# Altium project ContollerRMC.PrjPcb
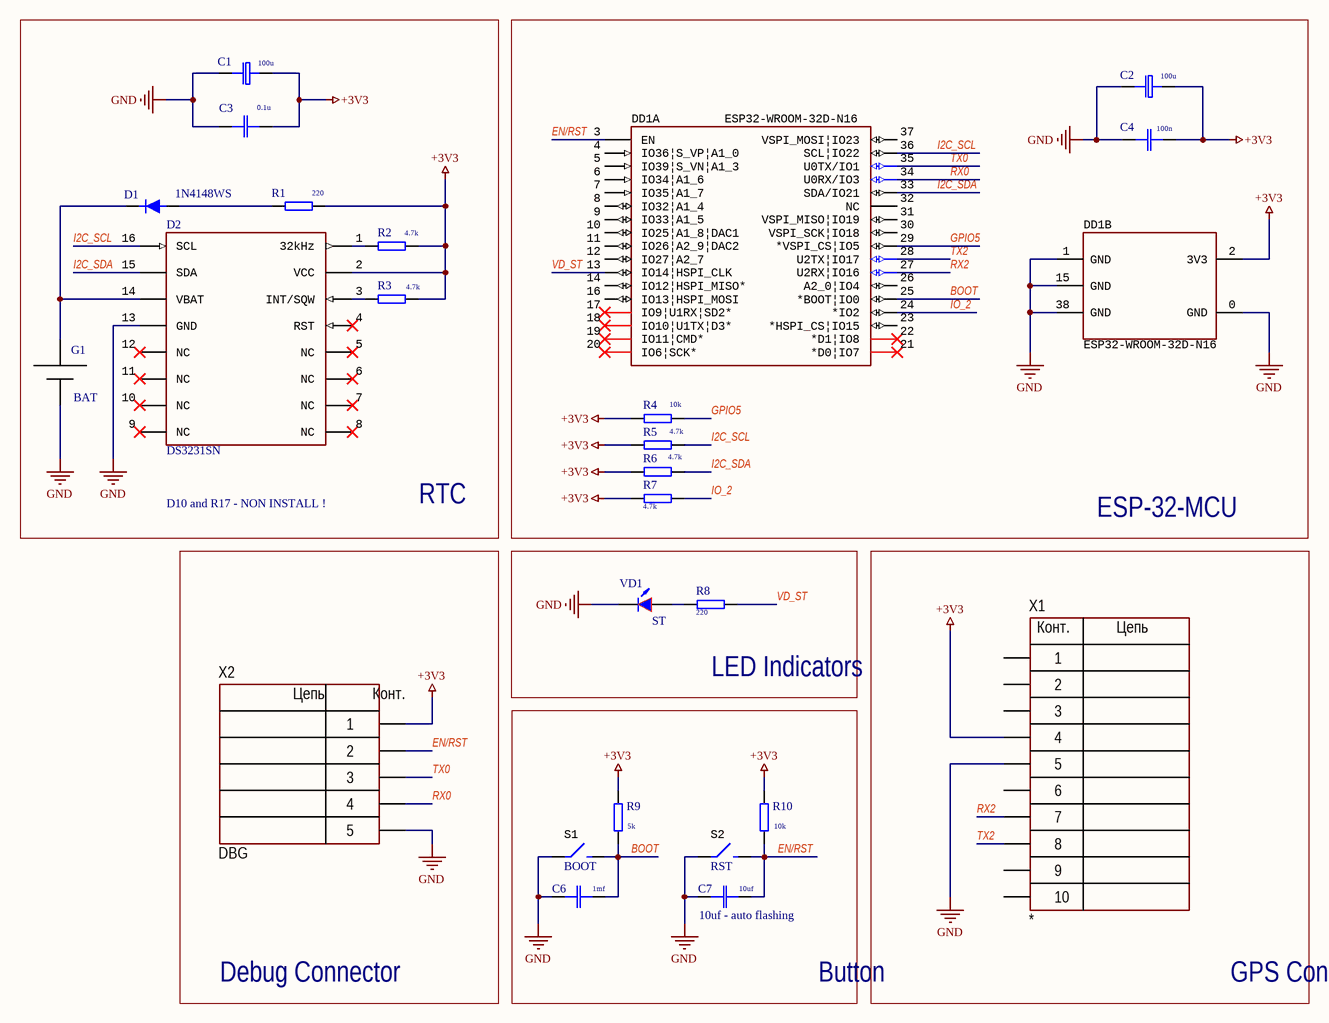
[diagram p0: ContollerRMC.SchDoc]
1 sheet, 25 parts. Net scope: global (net labels, ports and power ports of the same name join across sheets).
Board file: ContollerRMC.PcbDoc

## Sheet ContollerRMC.SchDoc: 0846 ControllerBoard
size A3; Revision: rev.0

### Parts
C1  100u  [EL Case C (6032-28)]
C2  100u  [EL Case C (6032-28)]
C3  0.1u  [C0805(2013)]
C4  100n  [C1206(3216)]
C6  1mf  [C0805(2013)]
C7  10uf  [C0805(2013)]
D1  1N4148WS  [SOD323]
D2  DS3231SN  [SO16-300]
DD1  PartNumber: ESP32-WROOM-32D-N16  [ESP32-WROOM-32D]  (parts A,B of 2)
G1  BAT  [BAT: BTH-R36-20]
R1  220  [R0805]
R2  4.7k  [R0805]
R3  4.7k  [R0805]
R4  10k  [R0805]
R5  4.7k  [R0805]
R6  4.7k  [R0805]
R7  4.7k  [R0805]
R8  220  [R0805]
R9  5k  [R0805]
R10  10k  [R0805]
S1  BOOT  [BUT_SKRPACE010]
S2  RST  [BUT_SKRPACE010]
VD1  ST  [Led 0805-Blue]
X1  *  [CON: PLS-10 - 2.0mm]
X2  DBG  [CON: PLS-5]

### Blocks framed on the sheet
RTC: C1 C3 D1 D2 G1 R1-R3
ESP-32-MCU: C2 C4 DD1 R4-R7
Debug Connector: X2
LED Indicators: R8 VD1
GPS Connector: X1
Button: C6 C7 R9 R10 S1 S2

### Nets
+3V3: C1.1 C2.1 C3.2 C4.1 D2.2(VCC) DD1.2(3V3) R1.1 R2.2 R3.2 R4.1 R5.1 R6.1 R7.2 R9.1 R10.1 X1.4 X2.1
GND: C1.2 C2.2 C3.1 C4.2 C6.2 C7.2 D2.13(GND) DD1.0(GND) DD1.1(GND) DD1.15(GND) DD1.38(GND) G1.2(-) S1.1 S2.1 VD1.2(K) X1.5 X2.5
BOOT: C6.1 DD1.25(*BOOT|IO0) R9.2 S1.2
EN/RST: C7.1 DD1.3(EN) R10.2 S2.2 X2.2
GPIO5: DD1.29(*VSPI_CS|IO5) R4.2
I2C_SCL: D2.16(SCL) DD1.36(SCL|IO22) R5.2
I2C_SDA: D2.15(SDA) DD1.33(SDA/IO21) R6.2
IO_2: DD1.24(*IO2) R7.1
RX0: DD1.34(U0RX/IO3) X2.4
RX2: DD1.27(U2RX|IO16) X1.7
TX0: DD1.35(U0TX/IO1) X2.3
TX2: DD1.28(U2TX|IO17) X1.8
VD_ST: DD1.13(IO14|HSPI_CLK) R8.2
NetD1_1: D1.1(A) R1.2
NetD1_2: D1.2(C) D2.14(VBAT) G1.1(+)
NetD2_1: D2.1(32kHz) R2.1
NetD2_3: D2.3(INT/SQW) R3.1
NetR8_1: R8.1 VD1.1(A)

Not connected (* = marked no-connect by the designer): D2 4(RST)* 5(NC)* 6(NC)* 7(NC)* 8(NC)* 9(NC)* 10(NC)* 11(NC)* 12(NC)*; DD1 4(IO36|S_VP|A1_0) 5(IO39|S_VN|A1_3) 6(IO34|A1_6) 7(IO35|A1_7) 8(IO32|A1_4) 9(IO33|A1_5) 10(IO25|A1_8|DAC1) 11(IO26|A2_9|DAC2) 12(IO27|A2_7) 14(IO12|HSPI_MISO*) 16(IO13|HSPI_MOSI) 17(IO9|U1RX|SD2*)* 18(IO10|U1TX|D3*)* 19(IO11|CMD*)* 20(IO6|SCK*)* 21(*D0|IO7)* 22(*D1|IO8)* 23(*HSPI_CS|IO15) 26(A2_0|IO4) 30(VSPI_SCK|IO18) 31(VSPI_MISO|IO19) 32(NC) 37(VSPI_MOSI|IO23); X1 1 2 3 6 9 10

### Notes on the sheet
- D10 and R17 - NON INSTALL !
- (near C7) 10uf - auto flashing
- (in symbol 5-Connector) Цепь; Конт.
- (in symbol 10-Connector) Конт.; Цепь

### Library data of the parts
C1 C2 = 100u-6.3V: TECAP, 100 мкФ, 6.3 В, тип C, 10%; Manufacturer: Китай; PartNumber: TECAP100/6,3VC, 10%; HelpURL: https://www.chipdip.ru/product/tecap-100-mkf-6.3-v-tip-c-10; Package: 3.2 x 6 mm (LxW); Value: 100u
C3 C6 C7 = C-0805: SMD-0805; Price: 0.014
  C3: Value: 0.1u
  C6: Value: 1mf
  C7: Value: 10uf
C4 = C-1206   50V 100n: SMD-1206 50V Y5V +80/-20%; Price: 0.085; Value: 100n
D1 = 1N4148WS: SOD-323 100V 150mA; Price: 0.02
D2 = DS3231SN: I2C real-time clock (RTC) Integrated  RTC/TCXO/Crystal; MP: DS3231; MF: Maxim Integrated Products; Value: *; Package: SO16; Digi-Key_Part_Number: DS3231SN#T&R; Digi-Key_Purchase_URL: https://www.digikey.hk/product-detail/en/ohmite/FCSL76R005FER/FCSL76R005FERCT-ND/1853780?utm_source=snapeda&utm_medium=aggregator&utm_campaign=symbol; Datasheet: https://static.chipdip.ru/lib/859/DOC003859694.pdf
DD1 = ESP32 - WROOM - 32U: ESP32-D0WD, Wi-Fi, BLE, 80 - 240MHz; Manufacturer: Espressif; Interface: GPIO, SD, UART, SPI, SDIO, I2C, I2S, IR; Flash size:: 16 МБ; WiFi: 802.11 b/g/n (802.11n до 150 Мбит/с); Bluetooth: v4.2 BR/EDR и BLE; PowerVCC: 2.7...3.6; HelpURL: https://www.studiopieters.nl/esp32-pinout/; Datasheet: https://static.chipdip.ru/lib/789/DOC015789371.pdf
G1 = BATCR1220: BATTERY HOLDER COIN CR1220; MP: BH1220T-C-G; Value: *
R1-R10 = R-0805: SMD 0805 0.1W 5% 150V; Price: 0.017
  R1 R8: Value: 220
  R2 R3 R5-R7: Value: 4.7k
  R4 R10: Value: 10k
  R9: Value: 5k
S1 S2 = Button SMD 3х4х2.5: SMD Button, 3х4х2.5 mm, 24VDC, 50mA; PartNumber: SKRPACE010; Manufacturer: ALPS; Package: 3*4*2.5; Component Type: Кнопка тактовая SMD; Datasheet: https://static.chipdip.ru/lib/915/DOC041915396.pdf
VD1 = Led 0805 SMD 2013. TO-2013BC-BF: BLUE 247мКд, 120°, 468нМ; Price: 0.09; Datasheet: https://static.chipdip.ru/lib/736/DOC002736050.pdf; Color: Blue
X1 = 10-Connector: Model: *; Manufacturer: *; HelpURL: *; ComponentKind: *
X2 = 5-Connector: Model: DBG; Manufacturer: *; HelpURL: *; ComponentKind: *